# EAGLE design hexasense (EAGLE 6.4)
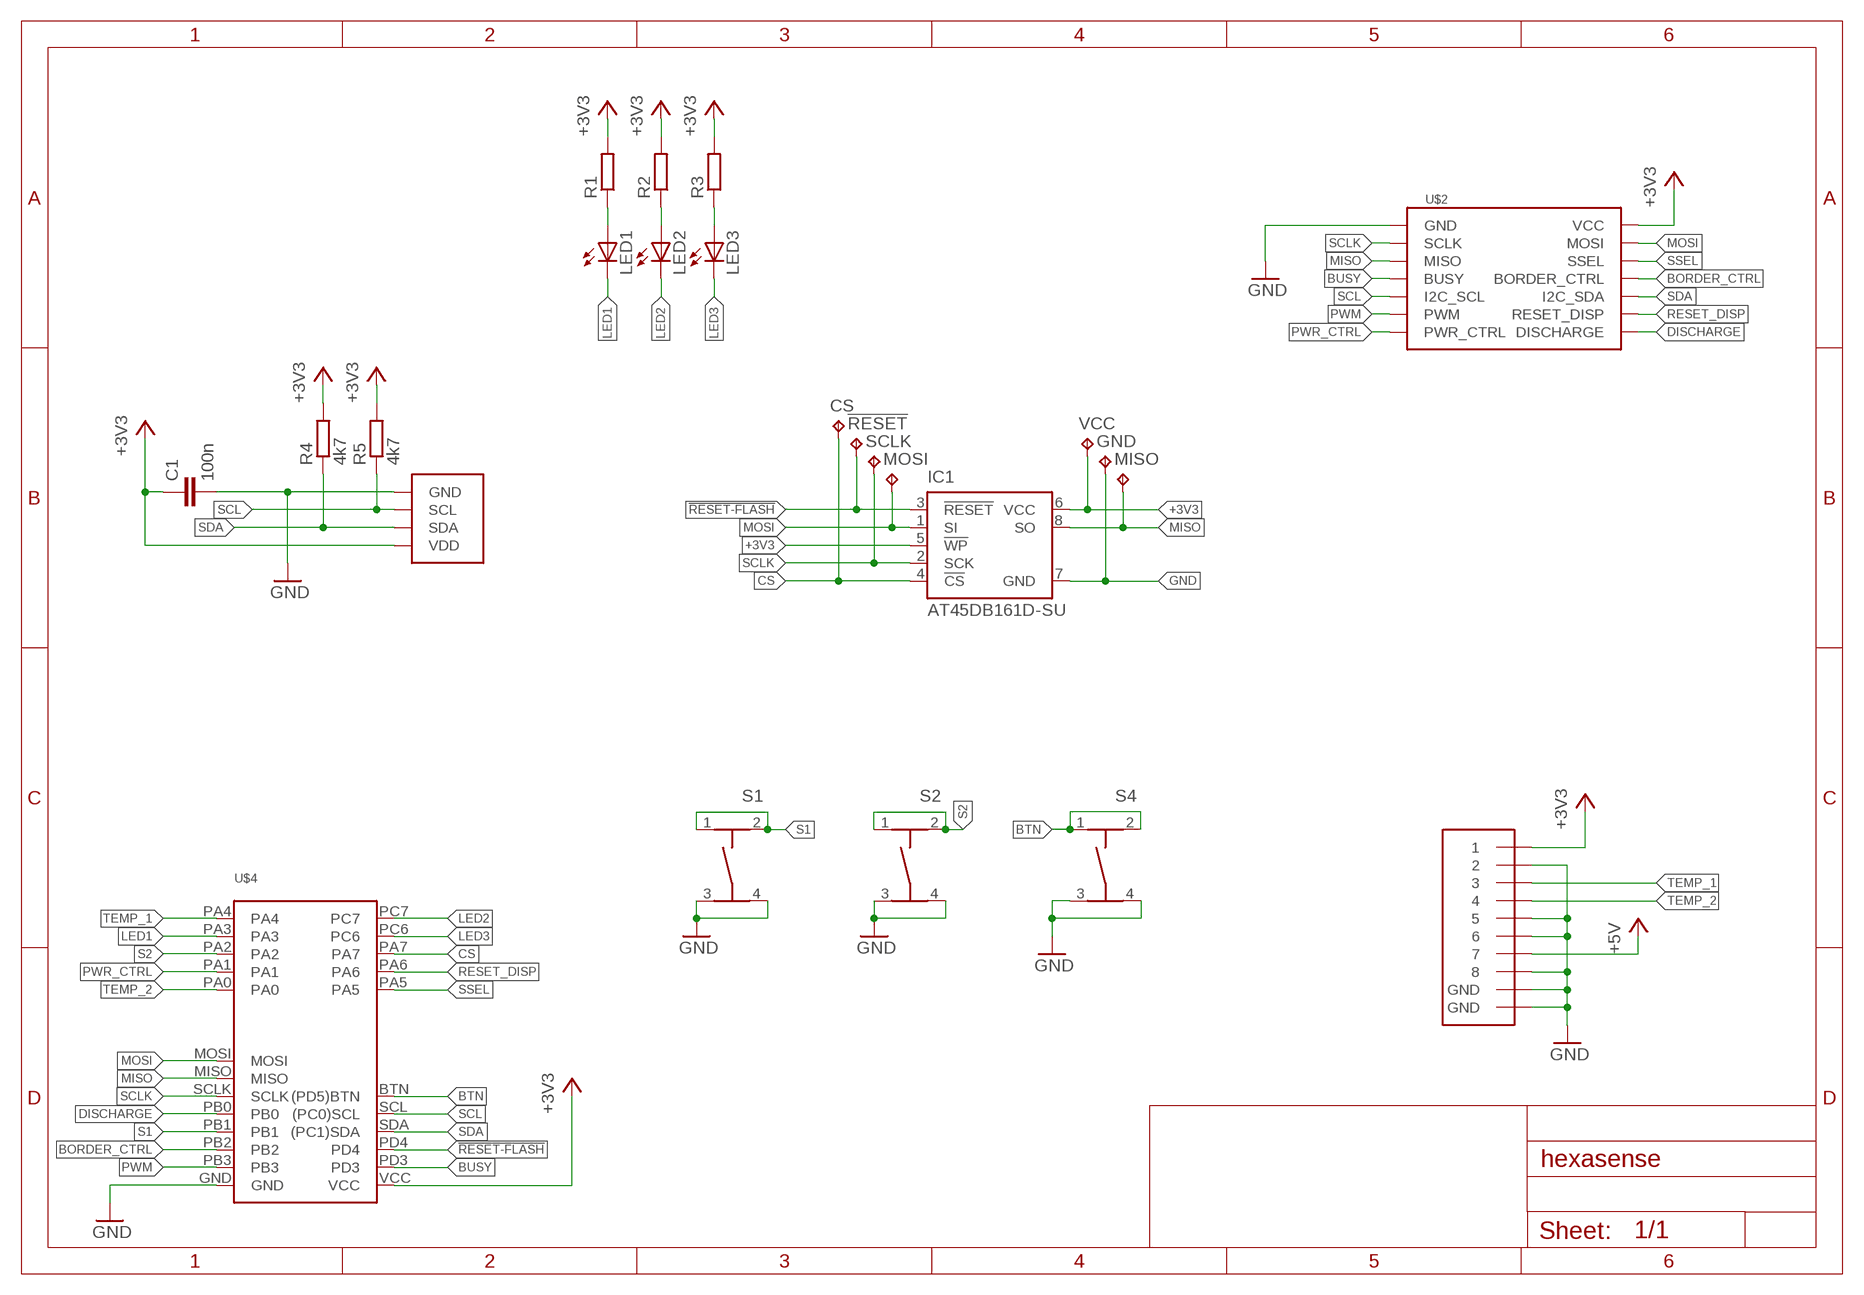
[diagram p0: schematic, sheet 1]

## Parts
!RESET  TPB1,27  [B1,27]
C1  100n  C-EUC0805  [C0805]
CS  TPB1,27  [B1,27]
GND  TPB1,27  [B1,27]
IC1  AT45DB161D-SU  [8S2]
LED1  LED3MM  [LED3MM]
LED2  LED3MM  [LED3MM]
LED3  LED3MM  [LED3MM]
MISO  TPB1,27  [B1,27]
MOSI  TPB1,27  [B1,27]
R1  R-EU_R0805  [R0805]
R2  R-EU_R0805  [R0805]
R3  R-EU_R0805  [R0805]
R4  4k7  R-EU_R0805  [R0805]
R5  4k7  R-EU_R0805  [R0805]
S1  TASTER-9314_SMD  [TASTER-9314_SMD]
S2  TASTER-9314_SMD  [TASTER-9314_SMD]
S4  TASTER-9314_SMD  [TASTER-9314_SMD]
SCLK  TPB1,27  [B1,27]
U$1  MEBP8-8G  [RJ45-REICHELT]
U$2  EPAPER  [EPAPER]
U$4  HEXABUS  [HEXABUS]
U$7  HYT271  [HYT271]
VCC  TPB1,27  [B1,27]

## Nets
!RESET-FLASH: !RESET.TP IC1.3(!RESET) U$4.PD4
+3V3: C1.1 IC1.5(!WP) IC1.6(VCC) R1.2 R2.2 R3.2 R4.2 R5.2 U$1.1 U$2.P2(VCC) U$4.VCC U$7.VDD VCC.TP
+5V: U$1.7
BORDER_CTRL: U$2.P8(BORDER_CTRL) U$4.PB2
BTN: S4.1 S4.2 U$4.BTN((PD5)BTN)
BUSY: U$2.P7(BUSY) U$4.PD3
CS: CS.TP IC1.4(!CS) U$4.PA7
DISCHARGE: U$2.P14(DISCHARGE) U$4.PB0
GND: C1.2 GND.TP IC1.7(GND) S1.3 S1.4 S2.3 S2.4 S4.3 S4.4 U$1.2 U$1.5 U$1.6 U$1.8 U$1.GND@1(GND) U$1.GND@2(GND) U$2.P1(GND) U$4.GND U$7.GND
LED1: LED1.K(C) U$4.PA3
LED2: LED2.K(C) U$4.PC7
LED3: LED3.K(C) U$4.PC6
MISO: IC1.8(SO) MISO.TP U$2.P5(MISO) U$4.MISO
MOSI: IC1.1(SI) MOSI.TP U$2.P4(MOSI) U$4.MOSI
N$1: LED3.A R3.1
N$2: LED2.A R2.1
N$3: LED1.A R1.1
PWM: U$2.P11(PWM) U$4.PB3
PWR_CTRL: U$2.P13(PWR_CTRL) U$4.PA1
RESET_DISP: U$2.P12(RESET_DISP) U$4.PA6
S1: S1.1 S1.2 U$4.PB1
S2: S2.1 S2.2 U$4.PA2
SCL: R5.1 U$2.P9(I2C_SCL) U$4.SCL((PC0)SCL) U$7.SCL
SCLK: IC1.2(SCK) SCLK.TP U$2.P3(SCLK) U$4.SCLK
SDA: R4.1 U$2.P10(I2C_SDA) U$4.SDA((PC1)SDA) U$7.SDA
SSEL: U$2.P6(SSEL) U$4.PA5
TEMP_1: U$1.3 U$4.PA4
TEMP_2: U$1.4 U$4.PA0

## Library data of the parts
!RESET CS GND MISO MOSI SCLK VCC = testpad:TP: Test pad
C1 = rcl:C-EU: CAPACITOR, European symbol
IC1 = atmel:AT45DB161D: 16-megabit 2.5V or 2.7V DataFlash Source: http://www.atmel.com/dyn/resources/prod_documents/doc3500.pdf; MF: ATMEL; MPN: AT45DB161D-SU; OC_FARNELL: 1455040
LED1-LED3 = led:LED: LED OSRAM: - CHIPLED LG R971, LG N971, LY N971, LG Q971, LY Q971, LO R971, LY R971 LH N974, LH R974 LS Q976, LO Q976, LY Q976 LO Q996 - Hyper CHIPLED LW Q18S LB Q993, LB Q99A, LB R99A - SideLED LS A670, LO A670, LY A670, LG A670, LP A670 LB A673, LV A673, LT A673, LW A673 LH A674 LY A675 LS A676, LA A676, LO A676, LY A676, LW A676 LS A679, LY A679, LG A679 - Hyper Micro SIDELED® LS Y876, LA Y876, LO Y876, LY Y876 LT Y87S - SmartLED LW L88C, LW L88S LB L89C, LB L89S, LG L890 LS L89K, LO L89K, LY L89K LS L896, LA L896, LO L896, LY L896 - TOPLED LS T670, LO T670, LY T670, LG T670, LP T670 LSG T670, LSP T670, LSY T670, LOP T670, LYG T670 LG T671, LOG T671, LSG T671 LB T673, LV T673, LT T673, LW T673 LH T674 LS T676, LA T676, LO T676, LY T676, LB T676, LH T676, LSB T676, LW T676 LB T67C, LV T67C, LT T67C, LS T67K, LO T67K, LY T67K, LW E67C LS E67B, LA E67B, LO E67B, LY E67B, LB E67C, LV E67C, LT E67C LW T67C LS T679, LY T679, LG T679 LS T770, LO T770, LY T770, LG T770, LP T770 LB T773, LV T773, LT T773, LW T773 LH T774 LS E675, LA E675, LY E675, LS T675 LS T776, LA T776, LO T776, LY T776, LB T776 LHGB T686 LT T68C, LB T68C - Hyper Mini TOPLED® LB M676 - Mini TOPLED Santana® LG M470 LS M47K, LO M47K, LY M47K Source: http://www.osram.convergy.de LUXEON: - LUMILED® LXK2-PW12-R00, LXK2-PW12-S00, LXK2-PW14-U00, LXK2-PW14-V00 LXK2-PM12-R00, LXK2-PM12-S00, LXK2-PM14-U00 LXK2-PE12-Q00, LXK2-PE12-R00, LXK2-PE12-S00, LXK2-PE14-T00, LXK2-PE14-U00 LXK2-PB12-K00, LXK2-PB12-L00, LXK2-PB12-M00, LXK2-PB14-N00, LXK2-PB14-P00, LXK2-PB14-Q00 LXK2-PR12-L00, LXK2-PR12-M00, LXK2-PR14-Q00, LXK2-PR14-R00 LXK2-PD12-Q00, LXK2-PD12-R00, LXK2-PD12-S00 LXK2-PH12-R00, LXK2-PH12-S00 LXK2-PL12-P00, LXK2-PL12-Q00, LXK2-PL12-R00 Source: www.luxeon.com KINGBRIGHT: KA-3528ASYC Source: www.kingbright.com
R1-R5 = rcl:R-EU_: RESISTOR, European symbol
S1 S2 S4 = Ergaenzung:TASTER-9314_SMD
U$1 = Reichelt:MEBP8-8G
U$2 = epaper:EPAPER
U$4 = hexabus:HEXABUS
U$7 = humidity:HYT271

## Board
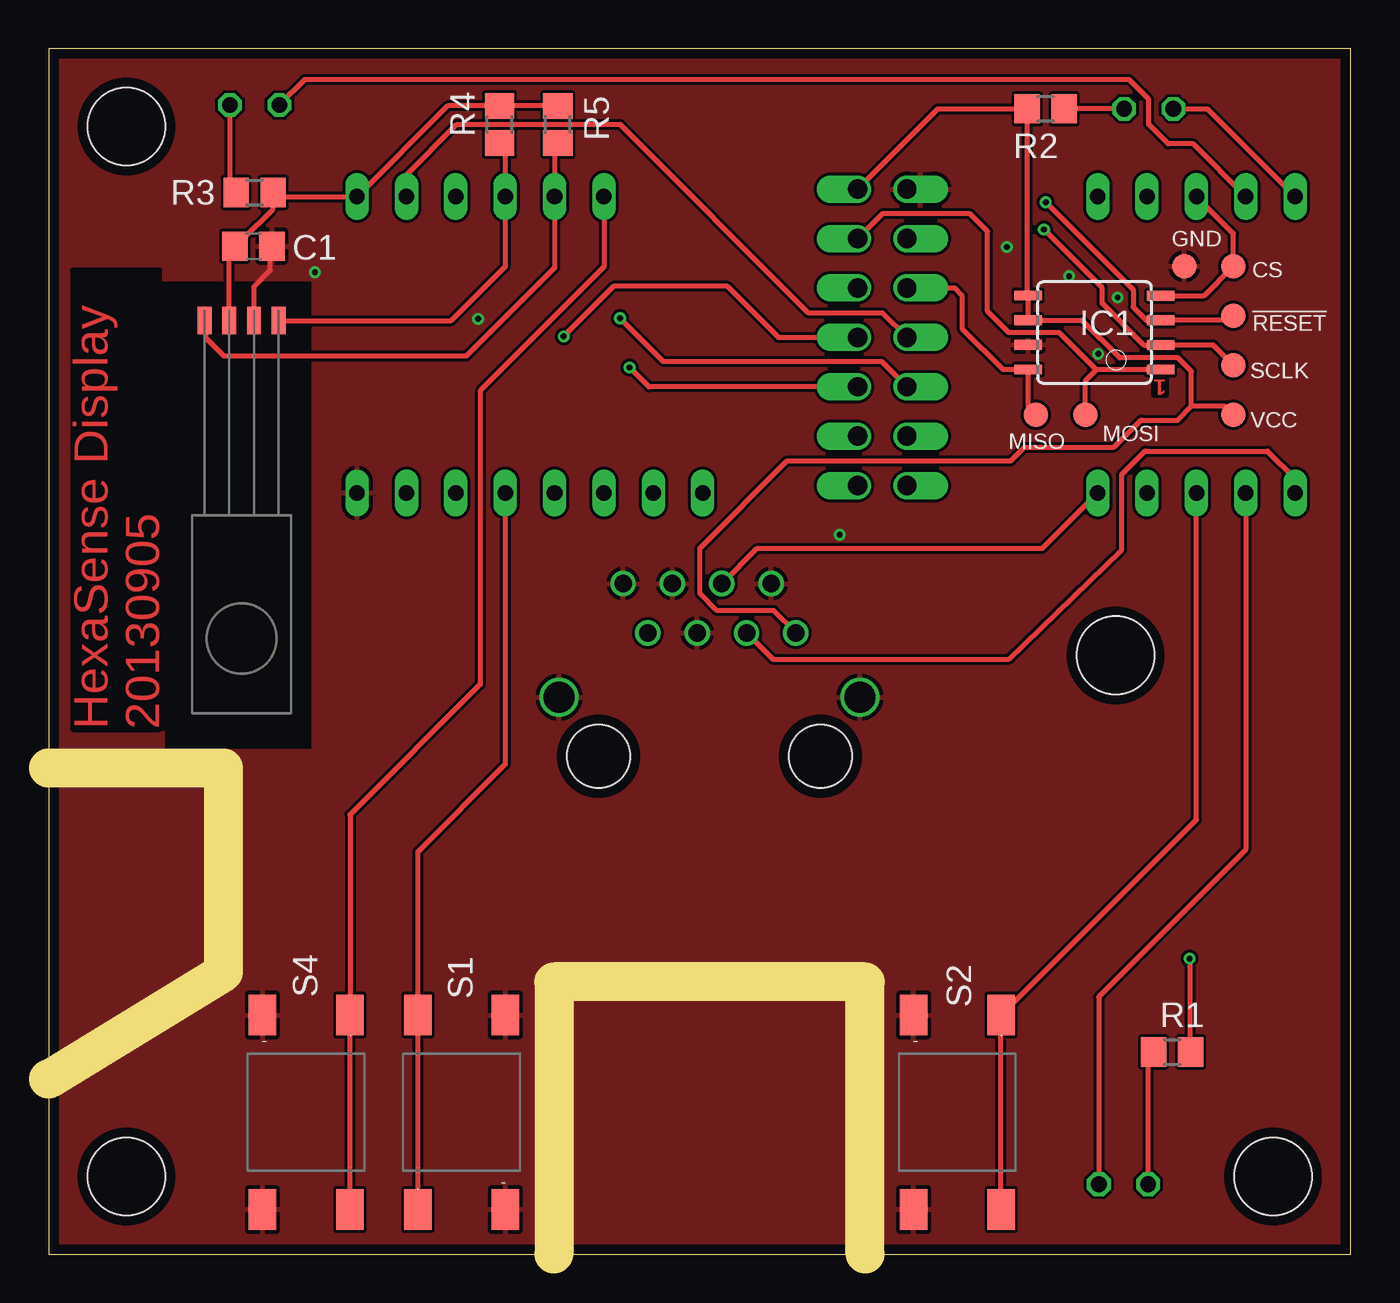
[diagram p1: board, top side]
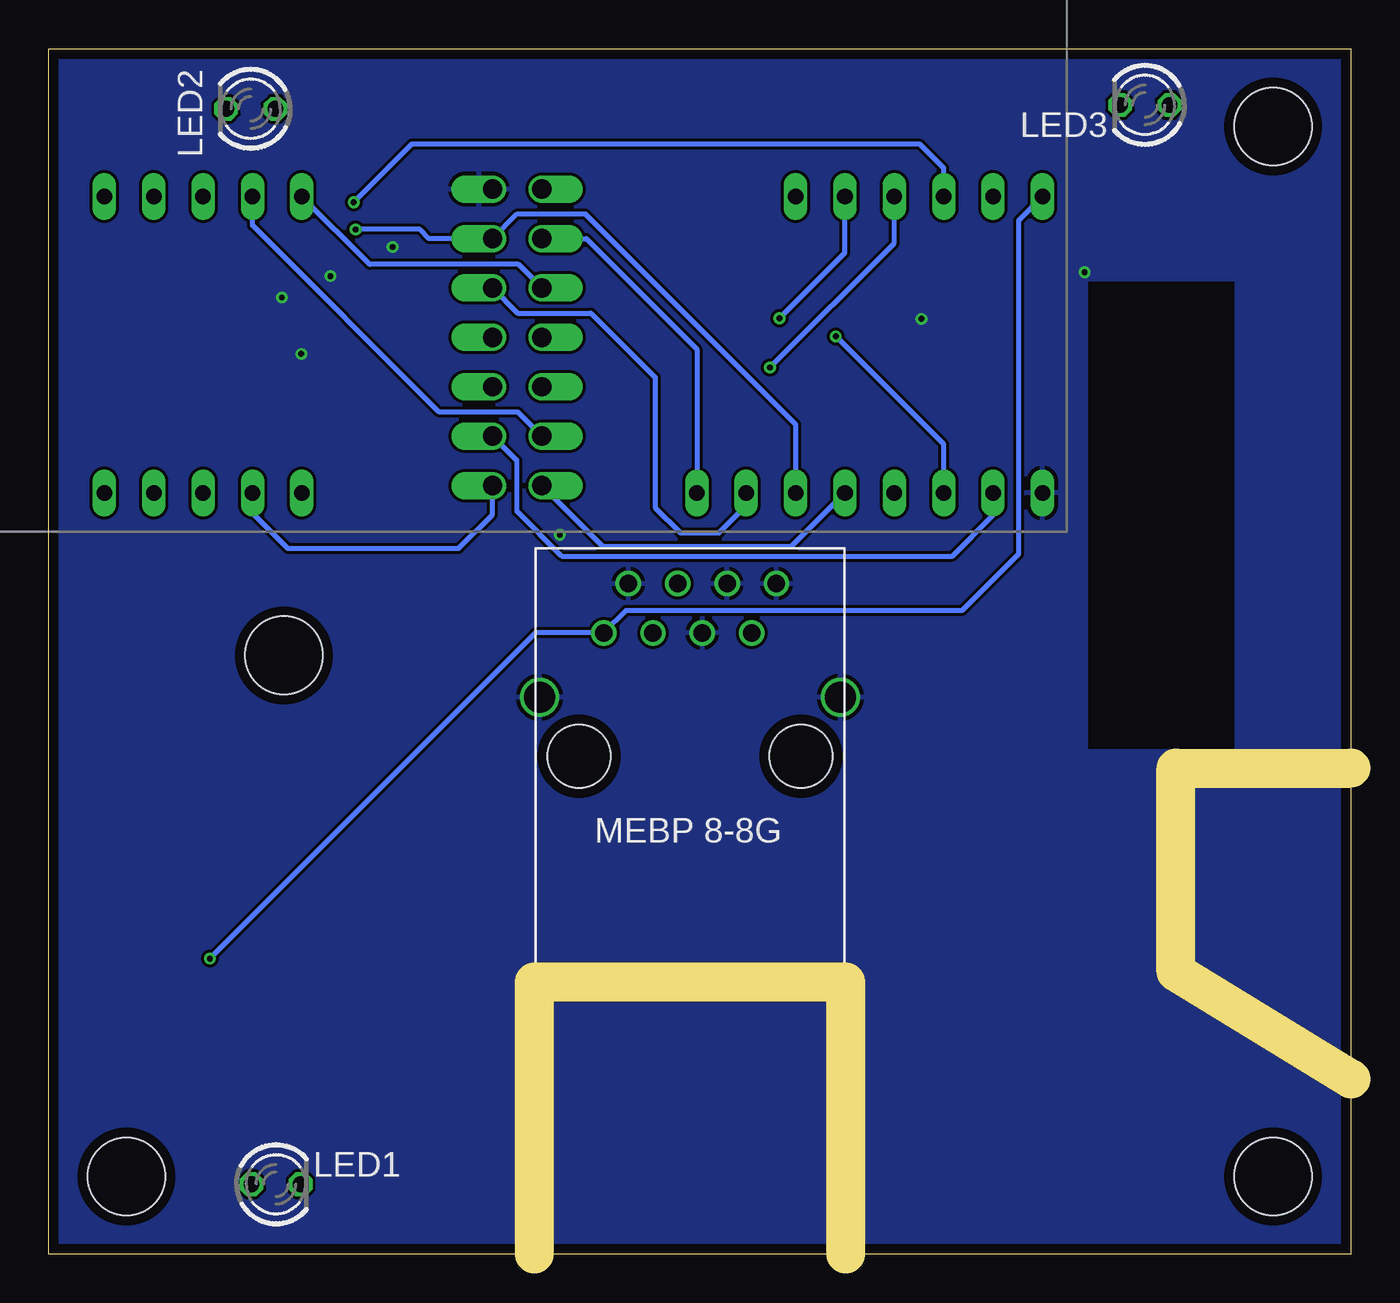
[diagram p2: board, bottom side, seen from below]

Size 67 x 62 mm. Coordinates in mm from the lower left corner, seen from the top.
Outline: 0,0 67,0 67,62 0,62 0,0
Copper layers (1*16): Top 0.035mm / dielectric 1.5mm / Bottom 0.035mm
Design rules "leiton": minimum track width 6mil, minimum drill 0.3mm, track to track 6mil, track to pad 6mil, pad to pad 6mil, via to via 6mil, smd to smd 6mil, copper to edge 20mil, drill to drill 8mil, minimum pad ring 8mil, minimum via ring 6mil, stop-mask expansion 3mil, vias tented up to drill 0mil, thermal gap 8mil
Holes 4 mm at 63,4 4,4 4,58 54.9,30.8
tRestrict: area 6,26 to 13.5,50
bRestrict: area 6,26 to 13.5,50
Milling: 6 lines

### Footprints (pad centres in the part's own frame; a part is rotated, then mirrored left to right if it is on the bottom)
B1,27 = smd 1.27 x 1.27: TP 0,0
C0805 = smd 1.3 x 1.5: 1 -0.95,0; 2 0.95,0
8S2 = smd 0.5 x 1.4: 1 -1.905,-3.404; 2 -0.645,-3.404; 3 0.625,-3.404; 4 1.895,-3.404; 5 1.905,3.404; 6 0.635,3.404; 7 -0.635,3.404; 8 -1.905,3.404
LED3MM = drill 0.813 octagon: A -1.27,0; K 1.27,0
R0805 = smd 1.3 x 1.5: 1 -0.95,0; 2 0.95,0
TASTER-9314_SMD = smd 2.1 x 1.4: 1 -5,2.25; 2 5,2.25; 3 -5,-2.25; 4 5,-2.25
RJ45-REICHELT = drill 0.9: 1 -4.445,6.35; 2 -3.175,8.89; 3 -1.905,6.35; 4 -0.635,8.89; 5 0.635,6.35; 6 1.905,8.89; 7 3.175,6.35; 8 4.445,8.89 | drill 1.6: GND@1 -7.745,3.05; GND@2 7.745,3.05 | hole 3.25: -5.715,0; 5.715,0
EPAPER = drill 1 offset: P1 10.16,8.77; P2 7.62,8.77; P3 10.16,6.23; P4 7.62,6.23; P5 10.16,3.69; P6 7.62,3.69; P7 10.16,1.15; P8 7.62,1.15; P9 10.16,-1.39; P10 7.62,-1.39; P11 10.16,-3.93; P12 7.62,-3.93; P13 10.16,-6.47; P14 7.62,-6.47
HEXABUS = drill 0.8 long: BTN 1.49,-13.53; GND -13.75,-26.23; MISO -13.75,-10.99; MOSI -13.75,-8.45; PA0 -13.75,11.87; PA1 -13.75,14.41; PA2 -13.75,16.95; PA3 -13.75,19.49; PA4 -13.75,22.03; PA5 1.49,11.87; PA6 1.49,14.41; PA7 1.49,16.95; PB0 -13.75,-16.07; PB1 -13.75,-18.61; PB2 -13.75,-21.15; PB3 -13.75,-23.69; PC6 1.49,19.49; PC7 1.49,22.03; PD3 1.49,-23.69; PD4 1.49,-21.15; SCL 1.49,-16.07; SCLK -13.75,-13.53; SDA 1.49,-18.61; VCC 1.49,-26.23
HYT271 = smd 0.711 x 1.422: GND -0.635,-10; SCL 1.905,-10; SDA -1.905,-10; VDD 0.635,-10

### Placement (x,y rotation side)
!RESET  60.96,48.26 0 top
C1  10.54,51.84 0 top
CS  60.96,50.8 0 top
GND  58.42,50.8 0 top
IC1  53.8,47.4 90 top
LED1  55.3,3.6 0 bottom
LED2  56.6,58.9 180 bottom
LED3  10.6,59.1 180 bottom
MISO  50.8,43.18 0 top
MOSI  53.34,43.18 0 top
R1  57.8,10.4 0 top
R2  51.3,58.9 180 top
R3  10.6,54.6 0 top
R4  23.2,58.1 90 top
R5  26.2,58.1 90 top
S1  21.25,7.3 90 top
S2  46.75,7.3 270 top
S4  13.25,7.3 270 top
SCLK  60.96,45.72 0 top
U$1  34,25.6 0 bottom
U$2  34,46 0 top
U$4  42.1,52.9 90 bottom
U$7  9.93,38.01 180 top
VCC  60.96,43.18 0 top

### Tracks (layer width: path | path; a pad name or v marks a point on that pad's centre or on a via)
!RESET-FLASH  (via drill 0.3)
  Top 0.254: !RESET.TP 60.73,48.02 IC1.3 56.48,48.02 55.8,48.7 55.8,49.6 v51.3,54.1
  Bottom 0.254: U$4.PD4 20.95,55.85 22.2,57.1 48.3,57.1 v51.3,54.1
+3V3  (via drill 0.3)
  Top 0.254: U$1.1 37.3,33.1 34.4,33.1 33.5,34 33.5,36.3 38,40.8 49.5,40.8 50.2,41.5 54.8,41.5 56.2,42.9 58.1,42.9 58.8,43.6 | U$2.P2 45.75,58.9 R2.2 50.35,49.35 IC1.5 IC1.6 53.16,48.03 55.1,46.1 58.1,46.1 58.8,45.4 58.8,43.6 | v58.7,15.2 58.7,10.45 R1.2 | VCC.TP 60.54,43.6 58.8,43.6 | U$7.VDD 9.29,51.84 C1.1 9.59,52.22 10.02,52.22 11.55,53.75 R3.2 11.76,54.39 U$4.VCC 20.53,59.05 R4.2 R5.2
  Bottom 0.254: v58.7,15.2 41.95,31.95 U$1.1 37.3,33.1 20,33.1 17.1,36 17.1,53.16 U$4.VCC
BORDER_CTRL  (via drill 0.3)
  Top 0.254: v26.5,47.2 29.1,49.8 34.9,49.8 37.55,47.15 U$2.P8
  Bottom 0.254: U$4.PB2 20.95,41.65 v26.5,47.2
BTN
  Top 0.254: S4.2 S4.1 15.5,22.6 22.2,29.3 22.2,44.4 28.57,50.77 U$4.BTN
BUSY
  Top 0.254: U$2.P7 42.91,48.4 39.1,48.4 29.4,58.1 21,58.1 18.41,55.51 U$4.PD3
CS
  Top 0.254: IC1.4 59.45,49.3 CS.TP 60.96,52.48 U$4.PA7
DISCHARGE
  Bottom 0.254: U$2.P14 38.49,36.4 28.78,36.4 U$4.PB0
GND  (via drill 0.3)
  Top 0.254: U$7.GND 10.56,49.77 11.4,50.6 11.4,51.75 C1.2
  other vias: 54,46.3 40.7,37 49.3,51.8 52.5,50.3 55,49.2 13.7,50.5 22.1,48.1
  pour Top: 0,0 67,0 67,62 0,62
  pour Bottom: 0,0 67,0 67,62 0,62
LED1
  Top 0.254: U$4.PA3 61.59,20.79 54.03,13.23 LED1.K
LED2
  Top 0.254: LED2.K 59.62,58.9 U$4.PC7
LED3
  Top 0.254: U$4.PC6 58.88,57.1 57.6,57.1 56.6,58.1 56.6,59.4 55.6,60.4 13.17,60.4 LED3.K
MISO
  Top 0.254: MISO.TP 50.4,43.58 IC1.8 49.1,45.5 47,47.6 47,49.3 46.61,49.69 U$2.P5
  Bottom 0.254: U$2.P5 42.87,48.4 39.1,48.4 35.8,45.1 35.8,38.4 34.5,37.1 32.5,37.1 31.11,38.49 U$4.MISO
MOSI
  Top 0.254: IC1.1 53.91,45.49 | 53.91,45.49 52,47.4 49.4,47.4 48.3,48.5 48.3,52.6 47.4,53.5 42.89,53.5 U$2.P4 | MOSI.TP 53.34,44.93 53.91,45.49
  Bottom 0.254: U$2.P4 39.33,52.23 33.65,46.55 U$4.MOSI
N$1
  Top 0.254: R3.1 9.33,54.92 LED3.A
N$2
  Top 0.254: LED2.A R2.1
N$3
  Top 0.254: LED1.A 56.57,10.12 arc-90 R1.1
PWM
  Bottom 0.254: U$2.P11 42.9,40.81 42.9,38.2 40.6,35.9 20.5,35.9 18.41,37.99 U$4.PB3
PWR_CTRL
  Bottom 0.254: U$4.PA1 56.51,38.11 54.7,36.3 45.9,36.3 44.16,38.04 U$2.P13
RESET_DISP
  Bottom 0.254: U$2.P12 42.85,43.3 46.9,43.3 56.51,52.91 U$4.PA6
S1
  Top 0.254: S1.1 S1.2 19,20.7 23.49,25.19 U$4.PB1
S2
  Top 0.254: U$4.PA2 59.05,22.35 S2.1 S2.2
SCL  (via drill 0.3)
  Top 0.254: U$7.SCL 8.1,47.94 8.1,47.1 9,46.2 21.5,46.2 26.03,50.73 U$4.SCL 26.03,56.98 R5.1 | U$2.P9 42.87,45.9 31.63,45.9 v29.4,48.13
  Bottom 0.254: v29.4,48.13 26.03,51.5 U$4.SCL
SCLK  (via drill 0.3)
  Top 0.254: SCLK.TP 59.92,46.76 IC1.2 56.34,46.76 54.2,48.9 54.2,49.7 v51.2,52.7
  Bottom 0.254: U$4.SCLK 28.57,42.67 39.4,53.5 42.89,53.5 U$2.P3 47.43,52.23 47.9,52.7 v51.2,52.7
SDA  (via drill 0.3)
  Top 0.254: U$7.SDA 20.71,48.01 23.49,50.79 U$4.SDA 23.49,56.86 R4.1 | U$2.P10 30.88,44.61 v29.89,45.6
  Bottom 0.254: v29.89,45.6 23.49,52 U$4.SDA
SSEL
  Bottom 0.254: U$2.P6 42.83,50.9 50.48,50.9 U$4.PA5
TEMP_1
  Top 0.254: U$1.3 37.26,30.6 49.4,30.6 55.19,36.2 55.19,40.09 56.4,41.3 62.7,41.3 64.13,39.87 U$4.PA4
TEMP_2
  Top 0.254: U$1.4 36.45,36.3 51.12,36.3 U$4.PA0

### Text on the board
Top: 1 | HexaSense Display / 20130905